# Altium schematic sheet sensor_single.SchDoc: Magic Baton: Single Sensor
size Letter
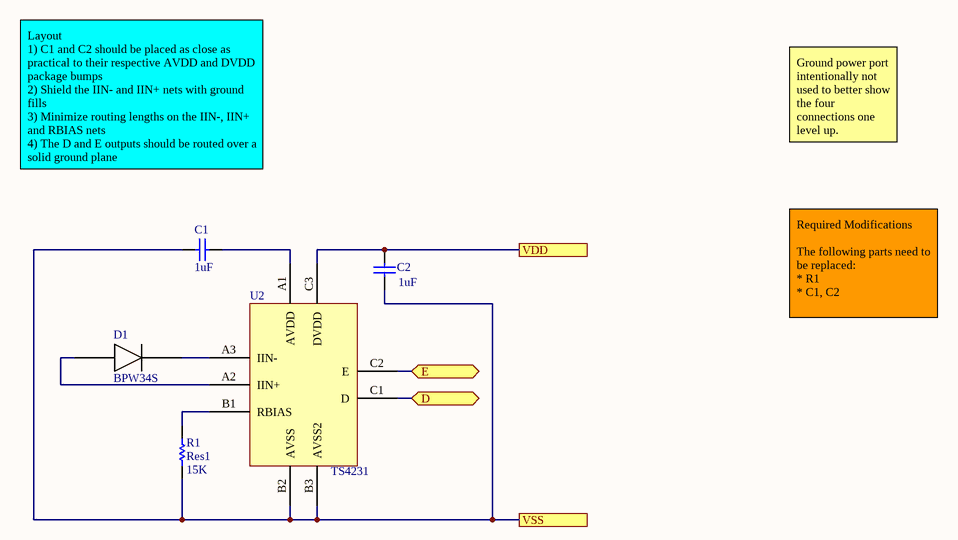
[diagram p0: sensor_single.SchDoc]

## Parts
C1  value 1uF  [RAD-0.3]  (hidden comment: Cap)
C2  value 1uF  [RAD-0.3]  (hidden comment: Cap)
D1  BPW34S
R1  Res1  value 15K  [AXIAL-0.3]
U2  TS4231

## Ports
D (bidir), E (bidir), VDD, VSS

## Nets
D: U2.C1(D) ; port D
E: U2.C2(E) ; port E
VDD: C2.1 U2.C3(DVDD) ; port VDD
VSS: C1.1 C2.2 R1.1 U2.B2(AVSS) U2.B3(AVSS2) ; port VSS
NetC1_2: C1.2 U2.A1(AVDD)
NetD1_A: D1.A U2.A2(IIN+)
NetD1_K: D1.K U2.A3(IIN-)
NetR1_2: R1.2 U2.B1(RBIAS)

## Notes on the sheet
- Layout
  1) C1 and C2 should be placed as close as practical to their respective AVDD and DVDD package bumps
  2) Shield the IIN- and IIN+ nets with ground fills
  3) Minimize routing lengths on the IIN-, IIN+ and RBIAS nets
  4) The D and E outputs should be routed over a solid ground plane
- Ground power port intentionally not used to better show the four connections one level up.
- Required Modifications
  The following parts need to be replaced:
  * R1
  * C1, C2
- Title
- Size:
- Date:
- Letter
- Number:
- Time:
- Revision:
- Sheet
- of
- File:

## Library data of the parts
C1 C2 = Cap: Capacitor; Published: 8-Jun-2000; LatestRevisionDate: 17-Jul-2002; LatestRevisionNote: Re-released for DXP Platform.; PackageReference: RAD-0.3; Publisher: Altium Limited; PackageDescription: Radial Cap, Thru-Hole; 2 Leads; 0.3 in Pin Spacing
D1 = BPW34S: Silicon PIN Photodiode
R1 = Res1: Resistor; Published: 8-Jun-2000; LatestRevisionDate: 17-Jul-2002; LatestRevisionNote: Re-released for DXP Platform.; PackageReference: AXIAL-0.3; Publisher: Altium Limited; PackageDescription: Axial Device, Thru-Hole; 2 Leads; 0.3 in Pin Spacing
U2 = TS4231: Light to digital convertor for SteamVR 2.0 tracking.